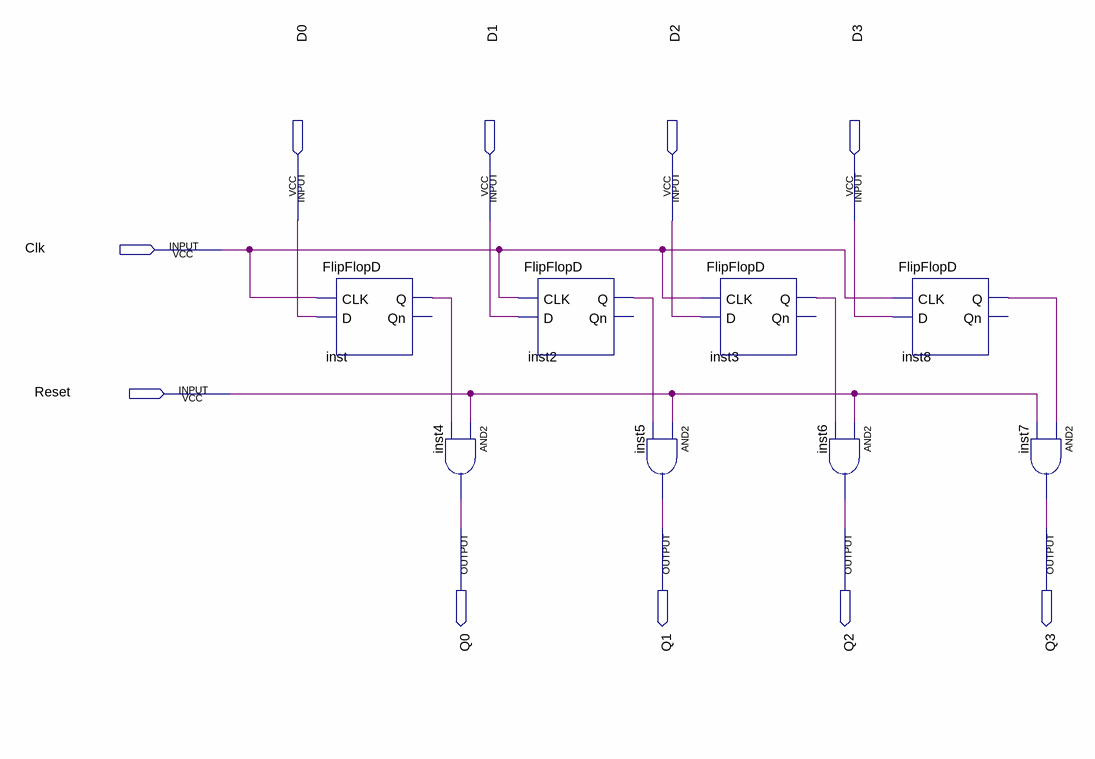
[diagram p0: schematic sheet]
// Quartus schematic Registradores.bdf as structural Verilog: 8 symbols, 10 pins
module Registradores (
  input  D0,
  input  D1,
  input  D2,
  input  D3,
  input  Clk,
  input  Reset,
  output Q0,
  output Q1,
  output Q2,
  output Q3
);

  wire inst2_q, inst3_q, inst8_q, inst_q;

  FlipFlopD inst (.CLK(Clk), .D(D0), .Q(inst_q));  // open: Qn
  and inst4 (Q0, Reset, inst_q);
  FlipFlopD inst2 (.CLK(Clk), .D(D1), .Q(inst2_q));  // open: Qn
  and inst5 (Q1, Reset, inst2_q);
  FlipFlopD inst3 (.CLK(Clk), .D(D2), .Q(inst3_q));  // open: Qn
  and inst6 (Q2, Reset, inst3_q);
  FlipFlopD inst8 (.CLK(Clk), .D(D3), .Q(inst8_q));  // open: Qn
  and inst7 (Q3, inst8_q, Reset);
endmodule
